# EAGLE schematic bletka (EAGLE 8.2.0)
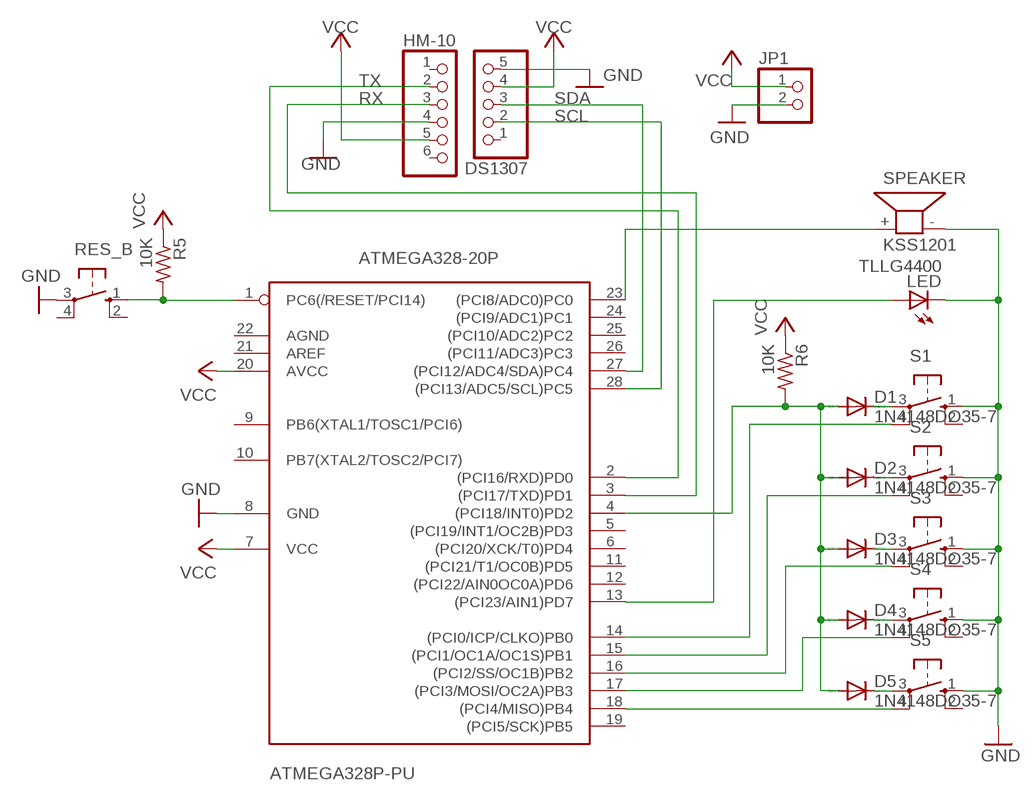
[diagram p0: schematic, sheet 1]

## Parts
ATMEGA328P-PU  ATMEGA328-20P  [DIL28-3]
D1  1N4148DO35-7  [DO35-7]
D2  1N4148DO35-7  [DO35-7]
D3  1N4148DO35-7  [DO35-7]
D4  1N4148DO35-7  [DO35-7]
D5  1N4148DO35-7  [DO35-7]
DS1307  PINHD-1X5  [1X05]
HM-10  PINHD-1X6  [1X06]
JP1  PINHD-1X2  [1X02]
LED  TLLG4400  [LED3MM]
R5  10K  R-US_0207/10  [0207/10]
R6  10K  R-US_0207/10  [0207/10]
RES_B  10-XX  [B3F-10XX]
S1  10-XX  [B3F-10XX]
S2  10-XX  [B3F-10XX]
S3  10-XX  [B3F-10XX]
S4  10-XX  [B3F-10XX]
S5  10-XX  [B3F-10XX]
SPEAKER  KSS1201  [KSS1201]

## Nets
GND: ATMEGA328P-PU.8(GND) DS1307.5 HM-10.4 JP1.2 LED.K(C) RES_B.3(P) S1.1(S) S2.1(S) S3.1(S) S4.1(S) S5.1(S) SPEAKER.-
INT0: ATMEGA328P-PU.4((PCI18/INT0)PD2) D1.A D2.A D3.A D4.A D5.A R6.2
N$6: D1.C S1.3(P)
N$7: D5.C S5.3(P)
N$8: D2.C S2.3(P)
N$9: D3.C S3.3(P)
N$10: D4.C S4.3(P)
PB0: ATMEGA328P-PU.14((PCI0/ICP/CLKO)PB0) S1.4(P1)
PB1: ATMEGA328P-PU.15((PCI1/OC1A/OC1S)PB1) S2.4(P1)
PB2: ATMEGA328P-PU.16((PCI2/SS/OC1B)PB2) S3.4(P1)
PB3: ATMEGA328P-PU.17((PCI3/MOSI/OC2A)PB3) S4.4(P1)
PB4: ATMEGA328P-PU.18((PCI4/MISO)PB4) S5.4(P1)
PC0: ATMEGA328P-PU.23((PCI8/ADC0)PC0) SPEAKER.+
PD7: ATMEGA328P-PU.13((PCI23/AIN1)PD7) LED.A
RESET: ATMEGA328P-PU.1(PC6(/RESET/PCI14)) R5.2 RES_B.1(S)
RX: ATMEGA328P-PU.3((PCI17/TXD)PD1) HM-10.3
SCL: ATMEGA328P-PU.28((PCI13/ADC5/SCL)PC5) DS1307.2
SDA: ATMEGA328P-PU.27((PCI12/ADC4/SDA)PC4) DS1307.3
TX: ATMEGA328P-PU.2((PCI16/RXD)PD0) HM-10.2
VCC: ATMEGA328P-PU.7(VCC) ATMEGA328P-PU.20(AVCC) DS1307.4 HM-10.5 JP1.1 R5.1 R6.1
Unconnected: ATMEGA328P-PU.5((PCI19/INT1/OC2B)PD3) ATMEGA328P-PU.6((PCI20/XCK/T0)PD4) ATMEGA328P-PU.9(PB6(XTAL1/TOSC1/PCI6)) ATMEGA328P-PU.10(PB7(XTAL2/TOSC2/PCI7)) ATMEGA328P-PU.11((PCI21/T1/OC0B)PD5) ATMEGA328P-PU.12((PCI22/AIN0OC0A)PD6) ATMEGA328P-PU.19((PCI5/SCK)PB5) ATMEGA328P-PU.21(AREF) ATMEGA328P-PU.22(AGND) ATMEGA328P-PU.24((PCI9/ADC1)PC1) ATMEGA328P-PU.25((PCI10/ADC2)PC2) ATMEGA328P-PU.26((PCI11/ADC3)PC3) DS1307.1 HM-10.1 HM-10.6 RES_B.2(S1) RES_B.4(P1) S1.2(S1) S2.2(S1) S3.2(S1) S4.2(S1) S5.2(S1)

## Library data of the parts
ATMEGA328P-PU = atmega328:ATMEGA328*P: MICROCONTROLLER 32 kBytes FLASH 2 kBytes SRAM 1 kBytes EEPROM USART 8-channel 10 bit ADC
D1-D5 = diode:1N4148: DIODE high speed (Philips)
DS1307 = pinhead:PINHD-1X5: PIN HEADER
HM-10 = pinhead:PINHD-1X6: PIN HEADER
JP1 = pinhead:PINHD-1X2: PIN HEADER
LED = led:TLLG4400: Low Current (2mA) LED 3 mm Tinted Diffused Package color GREEN Source: Data sheet <http://www.farnell.com/datasheets/391098.pdf>; MF: VISHAY SEMICONDUCTOR; OC_FARNELL: 1612435
R5 R6 = adafruit:R-US_: RESISTOR, American symbol
RES_B S1-S5 = switch-omron:10-XX: OMRON SWITCH; MPN: B3F-1000; OC_FARNELL: 176432; OC_NEWARK: 36M3542
SPEAKER = buzzer:KSS1201: SPEAKER Source: Schukat; OC_FARNELL: unknown; OC_NEWARK: unknown

## Net classes
0 default: width 0.5 mm